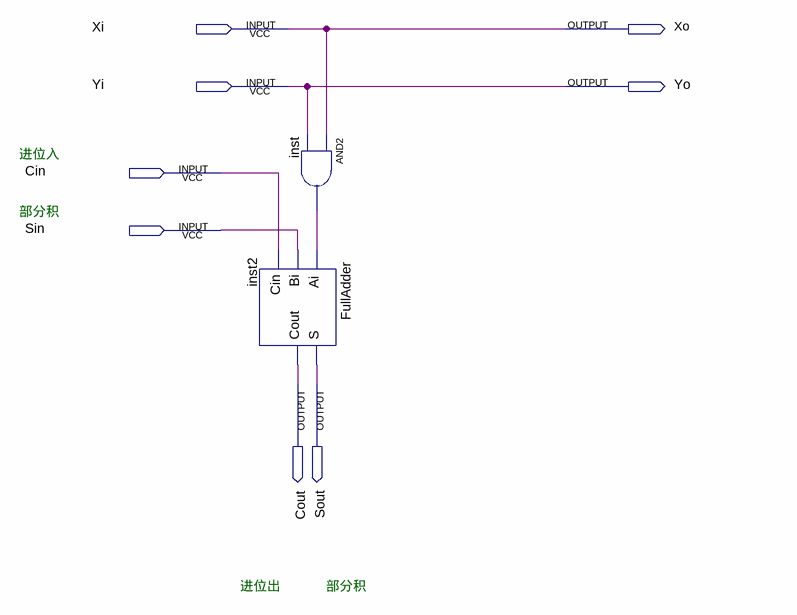
[diagram p0: schematic sheet]
// Quartus schematic MultiUnit.bdf as structural Verilog: 2 symbols, 8 pins
module MultiUnit (
  input  Xi,
  input  Yi,
  input  Cin,
  input  Sin,
  output Xo,
  output Yo,
  output Cout,
  output Sout
);

  wire inst_out;

  FullAdder inst2 (.Ai(inst_out), .Bi(Sin), .Cin(Cin), .S(Sout), .Cout(Cout));
  and inst (inst_out, Xi, Yi);

  assign Xo = Xi;
  assign Yo = Yi;

  // Notes on the sheet:
  //   进位入
  //   部分积
  //   进位出
  //   部分积
endmodule
